# Altium schematic sheet Portable Power Source.SchDoc
size A4
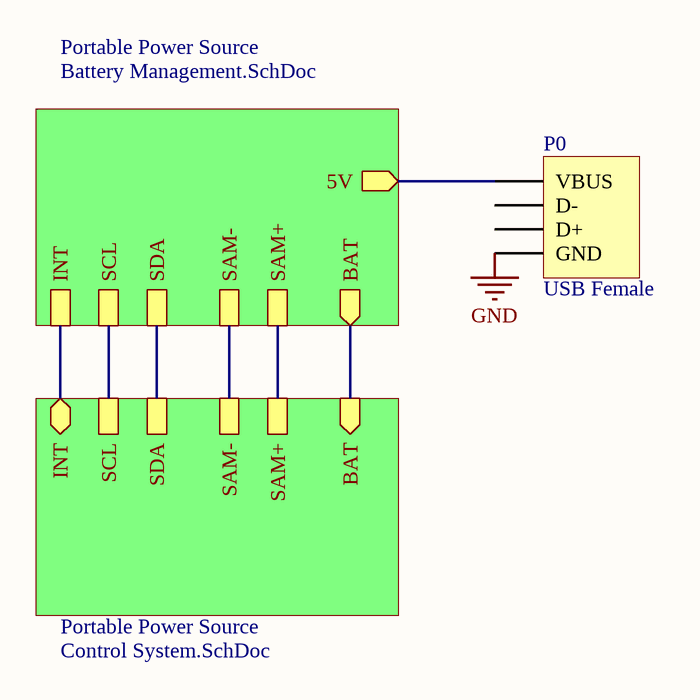
[diagram p0: Portable Power Source.SchDoc]

## Parts
P0  USB Female  [USB Female]

## Sub-sheets
Portable Power Source = Battery Management.SchDoc: SDA, SCL, INT, 5V (out), BAT (out), SAM-, SAM+
Portable Power Source = Control System.SchDoc: BAT (in), SCL, SDA, SAM-, SAM+, INT

## Nets
GND: P0.4(GND)
NetP0_1: P0.1(VBUS) ; sheet Portable Power Source/5V
(unnamed): sheet Portable Power Source/SDA, sheet Portable Power Source/SDA
(unnamed): sheet Portable Power Source/SCL, sheet Portable Power Source/SCL
(unnamed): sheet Portable Power Source/INT, sheet Portable Power Source/INT
(unnamed): sheet Portable Power Source/BAT, sheet Portable Power Source/BAT
(unnamed): sheet Portable Power Source/SAM-, sheet Portable Power Source/SAM-
(unnamed): sheet Portable Power Source/SAM+, sheet Portable Power Source/SAM+

Not connected (* = marked no-connect by the designer): P0 2(D-) 3(D+)